# Altium schematic sheet bmsSlave_isospi.SchDoc
size A; SheetNumber: 4; SheetTotal: 4
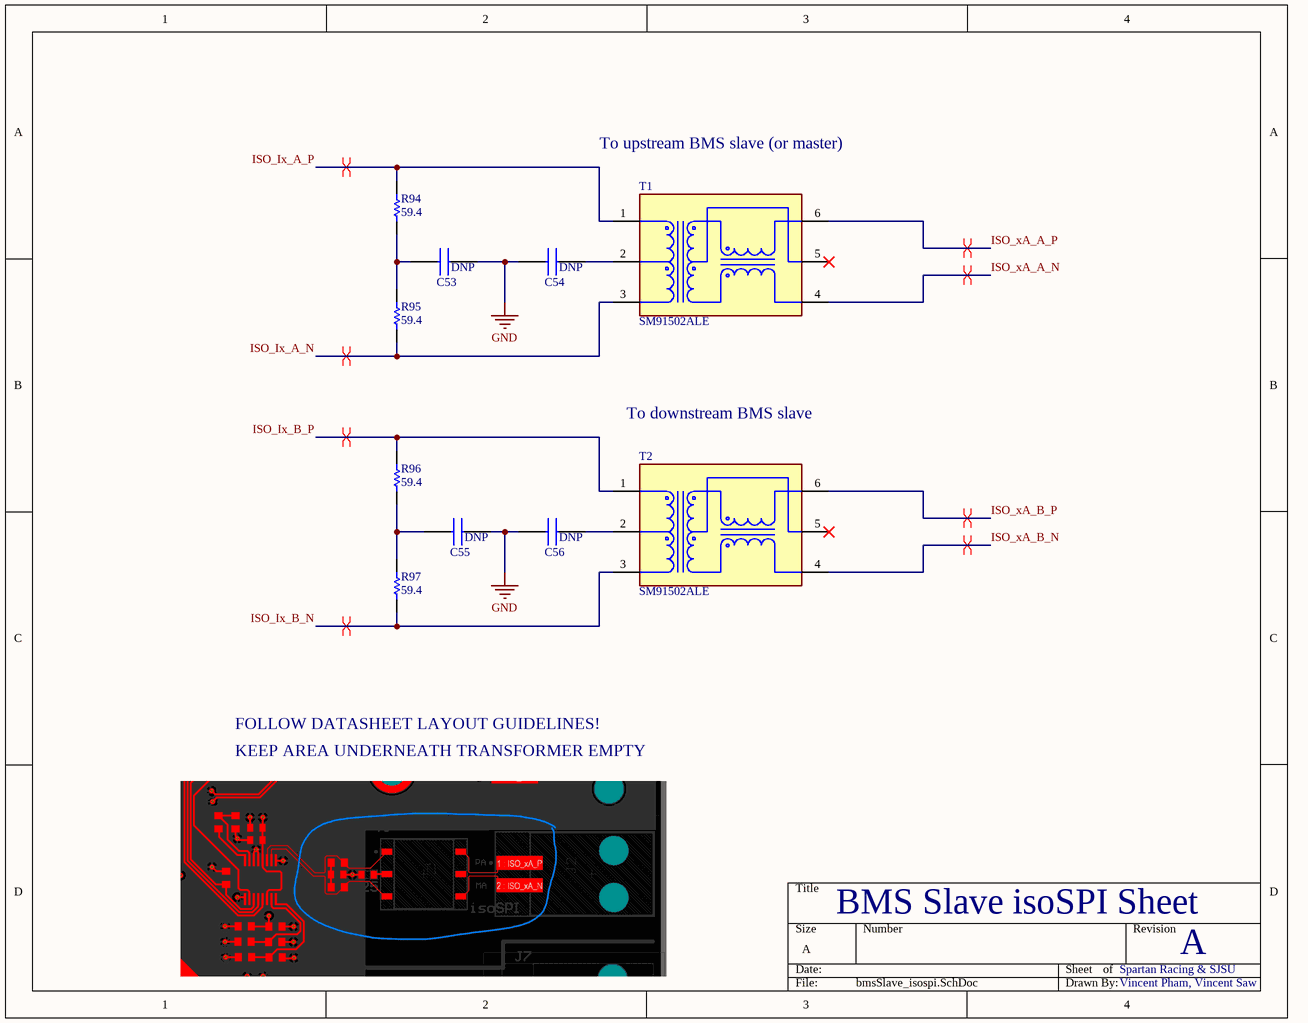
[diagram p0: bmsSlave_isospi.SchDoc]

## Parts
C53  885382207009  [C0603]  (value not drawn)
C54  885382207009  [C0603]  (value not drawn)
C55  885382207009  [C0603]  (value not drawn)
C56  885382207009  [C0603]  (value not drawn)
R94  value 59.4  [R0603]  (hidden comment: Resistor)
R95  value 59.4  [R0603]  (hidden comment: Resistor)
R96  value 59.4  [R0603]  (hidden comment: Resistor)
R97  value 59.4  [R0603]  (hidden comment: Resistor)
T1  SM91502ALE  [FP-SM91502ALE-MFG]
T2  SM91502ALE  [FP-SM91502ALE-MFG]

## Nets
GND: C53.1 C54.2 C55.1 C56.2
ISO_Ix_A_N: R95.2 T1.3
ISO_Ix_A_P: R94.1 T1.1
ISO_Ix_B_N: R97.2 T2.3
ISO_Ix_B_P: R96.1 T2.1
ISO_xA_A_N: T1.4
ISO_xA_A_P: T1.6
ISO_xA_B_N: T2.4
ISO_xA_B_P: T2.6
NetC53_2: C53.2 R94.2 R95.1
NetC54_1: C54.1 T1.2
NetC55_2: C55.2 R96.2 R97.1
NetC56_1: C56.1 T2.2

Not connected (* = marked no-connect by the designer): T1 5*; T2 5*

## Layout directives
differential pair: ISO_Ix_A_N, ISO_Ix_A_P, ISO_Ix_B_N, ISO_Ix_B_P, ISO_xA_A_N, ISO_xA_A_P, ISO_xA_B_N, ISO_xA_B_P

## Notes on the sheet
- To upstream BMS slave (or master)
- (near C53) DNP
- (near C54) DNP
- To downstream BMS slave
- (near C55) DNP
- (near C56) DNP
- FOLLOW DATASHEET LAYOUT GUIDELINES!
- KEEP AREA UNDERNEATH TRANSFORMER EMPTY
- BMS Slave isoSPI Sheet
- Spartan Racing & SJSU
- A
- Vincent Pham, Vincent Saw

## Library data of the parts
C53-C56 = 885382207009: Multilayer Ceramic Chip Capacitor WCAP-CSST Series 0805 10000pF X7R0805103K100DFCT1S000; Manufacturer_Name: Wurth Elektronik; Geometry.Height: 1.35mm; Mouser Part Number: 710-885382207009; Mouser Price/Stock: https://www.mouser.co.uk/ProductDetail/Wurth-Elektronik/885382207009?qs=0lSvoLzn4L%2FLliJ98PmFYg%3D%3D; Manufacturer_Part_Number: 885382207009; Datasheet Link: https://katalog.we-online.com/pbs/datasheet/885382207009.pdf
R94-R97 = Resistor: TC1: 0; SimulationGenericComponent: True; TC2: 0
T1 T2 = CMP-07264-000001-1: BMS XFORMER 1-CH 1000V AECQ +125; Manufacturer: Bourns; Standoff Height: 0.13mm; Turns Ratio: 1:1; Automotive Grade: Grade 1; Isolation Voltage: 4300VDC; Return Loss: -22dB; Insertion Loss: -0.25dB; Height: 5.72mm; Automotive: Yes; Package: 0; Device Class L3: unset; ComponentLink2Description: Datasheet; Category: Trans; ComponentLink2URL: https://www.bourns.com/docs/product-datasheets/SM91502AL.pdf; Device Class L1: Passive Components; Manufacturer Part Number: SM91502ALE; Temperature Range High: +125°C; Digikey Description: BMS XFORMER 1-CH 1000V AECQ +125; RoHS: TRUE; Lead Free: Yes; Octopart: https://octopart.com/sm91502ale-bourns-95732123; Device Class L2: Transformers; Temperature: -40°C to +125°C; Temperature Range Low: -40°C